# Altium schematic sheet BoostStage.SchDoc
size A
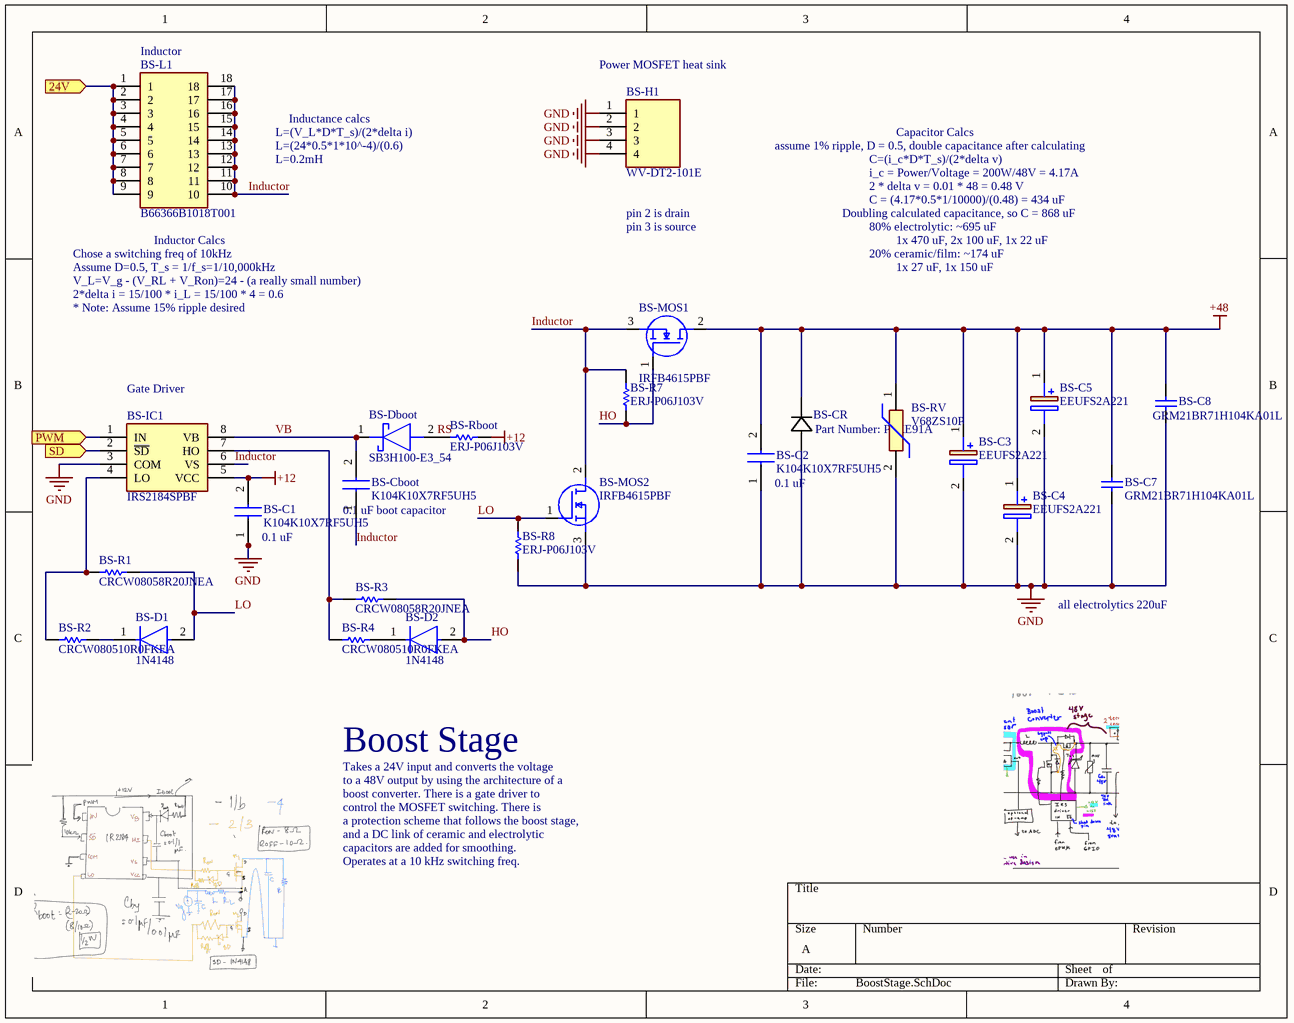
[diagram p0: BoostStage.SchDoc]

## Parts
BS-C1  K104K10X7RF5UH5  [K104K10X7RF5UH5]
BS-C2  K104K10X7RF5UH5  [K104K10X7RF5UH5]
BS-C3  EEUFS2A221  [CAPPRD500W65D1250H2700]
BS-C4  EEUFS2A221  [CAPPRD500W65D1250H2700]
BS-C5  EEUFS2A221  [CAPPRD500W65D1250H2700]
BS-C7  GRM21BR71H104KA01L  [CAPC2013X135X45ML10T25]
BS-C8  GRM21BR71H104KA01L  [CAPC2013X135X45ML10T25]
BS-Cboot  K104K10X7RF5UH5  [K104K10X7RF5UH5]
BS-CR  Part Number: P6KE91A  [P6KESeries]
BS-D1  1N4148  [FP-017AG-MFG]
BS-D2  1N4148  [FP-017AG-MFG]
BS-Dboot  SB3H100-E3_54  [DIOAD2855W132L835D505]
BS-H1  WV-DT2-101E  [WVDT2101E]
BS-IC1  IRS2184SPBF  [SOIC127P600X175-8N]
BS-L1  B66366B1018T001  [B66366B1018T001]
BS-MOS1  IRFB4615PBF  [TO254P483X1016X1994-3P]
BS-MOS2  IRFB4615PBF  [TO254P483X1016X1994-3P]
BS-R1  CRCW08058R20JNEA  [RESC2013X50X30NL20T20]
BS-R2  CRCW080510R0FKEA  [RESC2013X50X30NL20T20]
BS-R3  CRCW08058R20JNEA  [RESC2013X50X30NL20T20]
BS-R4  CRCW080510R0FKEA  [RESC2013X50X30NL20T20]
BS-R7  ERJ-P06J103V  [RESC2013X70X40ML20T20]
BS-R8  ERJ-P06J103V  [RESC2013X70X40ML20T20]
BS-Rboot  ERJ-P06J103V  [RESC2013X70X40ML20T20]
BS-RV  V68ZS10P  [V68ZS10P]

## Ports
24V (in), PWM (in), SD (in)

## Nets
+12: BS-C1.2 BS-IC1.5(VCC) BS-Rboot.2
+48: BS-C2.2 BS-C3.1(+) BS-C4.1(+) BS-C5.1(+) BS-C7.2 BS-C8.2 BS-CR.1 BS-MOS1.2(D) BS-RV.1
GND: BS-C1.1 BS-C2.1 BS-C3.2(-) BS-C4.2(-) BS-C5.2(-) BS-C7.1 BS-C8.1 BS-CR.2 BS-H1.1 BS-H1.2 BS-H1.3 BS-H1.4 BS-IC1.3(COM) BS-MOS2.3(S) BS-R8.1 BS-RV.2
24V: BS-L1.1 BS-L1.2 BS-L1.3 BS-L1.4 BS-L1.5 BS-L1.6 BS-L1.7 BS-L1.8 BS-L1.9 ; port 24V
HO: BS-D2.2(A) BS-MOS1.1(G) BS-R3.2 BS-R7.1
Inductor: BS-Cboot.1 BS-IC1.6(VS) BS-L1.10 BS-L1.11 BS-L1.12 BS-L1.13 BS-L1.14 BS-L1.15 BS-L1.16 BS-L1.17 BS-L1.18 BS-MOS1.3(S) BS-MOS2.2(D) BS-R7.2
LO: BS-D1.2(A) BS-MOS2.1(G) BS-R1.2 BS-R8.2
PWM: BS-IC1.1(IN) ; port PWM
RS: BS-Dboot.2(A) BS-Rboot.1
SD: BS-IC1.2(~{SD}) ; port SD
VB: BS-Cboot.2 BS-Dboot.1(K) BS-IC1.8(VB)
NetBS-D1_1: BS-D1.1(C) BS-R2.2
NetBS-D2_1: BS-D2.1(C) BS-R4.2
NetBS-IC1_4: BS-IC1.4(LO) BS-R1.1 BS-R2.1
NetBS-IC1_7: BS-IC1.7(HO) BS-R3.1 BS-R4.1

## Notes on the sheet
- (near BS-L1) Inductor
- (near BS-H1) Power MOSFET heat sink
- L=(V_L*D*T_s)/(2*delta i)
- L=(24*0.5*1*10^-4)/(0.6)
- L=0.2mH
- Inductance calcs
- assume 1% ripple, D = 0.5, double capacitance after calculating
- C=(i_c*D*T_s)/(2*delta v)
- Capacitor Calcs
- pin 2 is drain
- pin 3 is source
- Doubling calculated capacitance, so C = 868 uF
- C = (4.17*0.5*1/10000)/(0.48) = 434 uF
- i_c = Power/Voltage = 200W/48V = 4.17A
- 2 * delta v = 0.01 * 48 = 0.48 V
- 80% electrolytic: ~695 uF
- Chose a switching freq of 10kHz
- Assume D=0.5, T_s = 1/f_s=1/10,000kHz
- V_L=V_g - (V_RL + V_Ron)=24 - (a really small number)
- 2*delta i = 15/100 * i_L = 15/100 * 4 = 0.6
- (near BS-L1) Inductor Calcs
- 20% ceramic/film: ~174 uF
- 1x 470 uF, 2x 100 uF, 1x 22 uF
- 1x 27 uF, 1x 150 uF
- * Note: Assume 15% ripple desired
- (near BS-IC1) Gate Driver
- (near BS-C2) 0.1 uF
- (near BS-C1) 0.1 uF
- (near BS-Cboot) 0.1 uF boot capacitor
- all electrolytics 220uF
- Boost Stage
- Takes a 24V input and converts the voltage
- to a 48V output by using the architecture of a
- boost converter. There is a gate driver to
- and a DC link of ceramic and electrolytic
- control the MOSFET switching. There is
- a protection scheme that follows the boost stage,
- capacitors are added for smoothing.
- Operates at a 10 kHz switching freq.

## Library data of the parts
BS-C1 BS-C2 BS-Cboot = K104K10X7RF5UH5: Capacitor; Manufacturer_Name: Vishay; Datasheet Link: https://www.vishay.com/docs/45171/kseries.pdf; Height: 6.2mm; Manufacturer_Part_Number: K104K10X7RF5UH5; Mouser Part Number: 594-K104K10X7RF5UH5; Mouser Price/Stock: https://www.mouser.co.uk/ProductDetail/Vishay-BC-Components/K104K10X7RF5UH5?qs=rLgk8CAOBHbAqIwDswVbzA%3D%3D; Arrow Part Number: K104K10X7RF5UH5; Arrow Price/Stock: https://www.arrow.com/en/products/k104k10x7rf5uh5/vishay
BS-C3-BS-C5 = EEUFS2A221: Capacitor Polarised; Manufacturer_Name: Panasonic; Datasheet Link: https://industrial.panasonic.com/cdbs/www-data/pdf/RDF0000/ABA0000C1255.pdf; Height: 27mm; Manufacturer_Part_Number: EEUFS2A221
BS-C7 BS-C8 = CMP-2100-03644-1: Chip Capacitor, 0.1 uF, +/- 10%, 50 V, -55 to 125 degC, 0805 (2012 Metric), RoHS, Tape and Reel; Manufacturer: Murata; Voltage: 50V; Capacitance: 100nF; Insulation Resistance: 10GR; Dielectric Material: Ceramic; Dielectric: X7R; Package Description: 2-Pin Surface Mount Device, Body 2 x 1.25 mm; Manufacturer URL: http://www.murata.com/; Case Code (Imperial): 0805; Datasheet URL: http://psearch.en.murata.com/capacitor/product/GRM21BR71H104KA01%23.pdf; Termination: SMD/SMT; Lead Free: LeadFree; Package Quantity: 1; Mount: SurfaceMount; REACH SVHC: Unknown; Thickness: 0.053inch; Height: 1.25mm; Case/Package: 0805; Voltage Rating: 50V; Width: 0.049inch; Case Code (Metric): 2012; Material: Ceramic; Min Operating Temperature: -55degC; RoHSCompliant: true; Datasheet Version: 42675.0; Voltage Rating (DC): 50V; Tolerance: 10%; Package Reference: 0805; Depth: 1.25mm; Length: 2mm; Max Operating Temperature: 125degC; Packaging: TapeandReel; Number of Pins: 2; Radiation Hardening: No
BS-CR = P6KE91A: No Description Available; Vendor: Littelfuse Inc; Built_By: EMA_UL_Team; Manufacturer_Part_Number: P6KE91A; Copyright: Copyright (C) 2018 Accelerated Designs. All rights reserved; RefDes: RefDes; Type: DEV; Value: Value
BS-D1 BS-D2 = CMP-07163-000046-1: DIODE GEN PURP 100V 200MA DO35; Forward Voltage: 1V; Max Power Dissipation: 500mW; Max Reverse Current: 5uA; Forward Current: 300mA; Current: 4A; Reverse Recovery Time: 4ns; Element Configuration: Single; Outside Diameter: 1.85mm; Capacitance: 4pF; Polarity: Standard; Max Forward Surge Current (Ifsm): 1A; Reverse Voltage: 100V; Output Current: 200mA; Average Rectified Current: 200mA; Diameter: 1.91mm; Max Repetitive Reverse Voltage (Vrrm): 100V; Current Rating: 200mA; Case/Package: DO-35; Lead Free: Lead Free; Number of Pins: 2; Recovery Time: 4ns; Packaging: Bulk; Contact Plating: Tin; Voltage: 100V; Mount: Through Hole; Max Surge Current: 4A; Package Quantity: 2000; Width: 1.91mm; Max Reverse Voltage (DC): 100V; Length: 4.56mm; Radiation Hardening: No; Power Dissipation: 500mW; Voltage Rating (DC): 100V; Peak Non-Repetitive Surge Current: 4A; REACH SVHC: No SVHC; Height: 4.56mm; Max Operating Temperature: 175°C; Series: -; Weight: 0.01lb; Min Operating Temperature: -65°C
BS-Dboot = SB3H100-E3_54: Schottky Diode; Manufacturer_Name: Vishay; Manufacturer_Part_Number: SB3H100-E3/54; Datasheet Link: http://www.vishay.com/docs/88720/sb3h90.pdf; Mouser Part Number: 625-SB3H100-E3; Mouser Price/Stock: https://www.mouser.com/Search/Refine.aspx?Keyword=625-SB3H100-E3
BS-H1 = WV-DT2-101E: Power MOSFET heat sink; Manufacturer_Name: Ohmite; Datasheet Link: https://componentsearchengine.com/Datasheets/1/WV-DT2-101E.pdf; Height: 32.3mm; Manufacturer_Part_Number: WV-DT2-101E; Mouser Part Number: 588-WV-DT2-101E; Mouser Price/Stock: https://www.mouser.com/Search/Refine.aspx?Keyword=588-WV-DT2-101E
BS-IC1 = IRS2184SPBF: Integrated Circuit; Manufacturer_Name: Infineon; Datasheet Link: https://www.infineon.com/dgdl/irs2184.pdf?fileId=5546d462533600a401535676d8da27db; Height: 1.75mm; Manufacturer_Part_Number: IRS2184SPBF; Mouser Part Number: 942-IRS2184SPBF; Mouser Price/Stock: https://www.mouser.co.uk/ProductDetail/Infineon-IR/IRS2184SPBF?qs=dQmlx5f5cRJ1KO8jS8%252BNRA%3D%3D; Arrow Part Number: IRS2184SPBF; Arrow Price/Stock: https://www.arrow.com/en/products/irs2184spbf/infineon-technologies-ag
BS-L1 = B66366B1018T001: Undefined or Miscellaneous; Manufacturer_Name: TDK; Datasheet Link: http://uk.rs-online.com/web/p/products/1620179; Height: 38.4mm; Manufacturer_Part_Number: B66366B1018T001; Mouser Part Number: N/A; Mouser Price/Stock: https://www.mouser.co.uk/ProductDetail/EPCOS-TDK/B66366B1018T001?qs=w5o0Loj0u7MIqxMJwOyApA%3D%3D; Arrow Part Number: B66366B1018T001; Arrow Price/Stock: http://www.arrow.com/en/products/b66366b1018t001/epcos-tdk
BS-MOS1 BS-MOS2 = IRFB4615PBF: MOSFET (N-Channel); Manufacturer_Name: Infineon; Datasheet Link: https://static6.arrow.com/aropdfconversion/fc085eb00e813bec65c58b34c53aeea1d8b02a1f/irfb4615pbf.pdf; Height: 4.83mm; Manufacturer_Part_Number: IRFB4615PBF; Mouser Part Number: 942-IRFB4615PBF; Mouser Price/Stock: https://www.mouser.co.uk/ProductDetail/Infineon-Technologies/IRFB4615PBF?qs=9%252BKlkBgLFf20BbweusQYXA%3D%3D; Arrow Part Number: IRFB4615PBF; Arrow Price/Stock: https://www.arrow.com/en/products/irfb4615pbf/infineon-technologies-ag
BS-R1 BS-R3 = CMP-2001-04157-1: Manufacturer: Vishay Dale; Part Number: CRCW08058R20JNEA
BS-R2 BS-R4 = CMP-2001-04915-1: Manufacturer: Vishay Dale; Part Number: CRCW080510R0FKEA
BS-R7 BS-R8 BS-Rboot = CMP-2001-00478-1: Manufacturer: Panasonic; Part Number: ERJ-P06J103V
BS-RV = V68ZS10P: Varistor; Manufacturer_Name: LITTELFUSE; Datasheet Link: http://www.littelfuse.com/~/media/electronics/datasheets/varistors/littelfuse_varistor_za_datasheet.pdf.pdf; Height: 20mm; Manufacturer_Part_Number: V68ZS10P; Mouser Part Number: 576-V68ZS10P; Mouser Price/Stock: https://www.mouser.co.uk/ProductDetail/Littelfuse/V68ZS10P?qs=1%2FWRN91BpNvIRlTsONWDiQ%3D%3D